# EAGLE design lcd13264-shield (EAGLE 6.5.0)
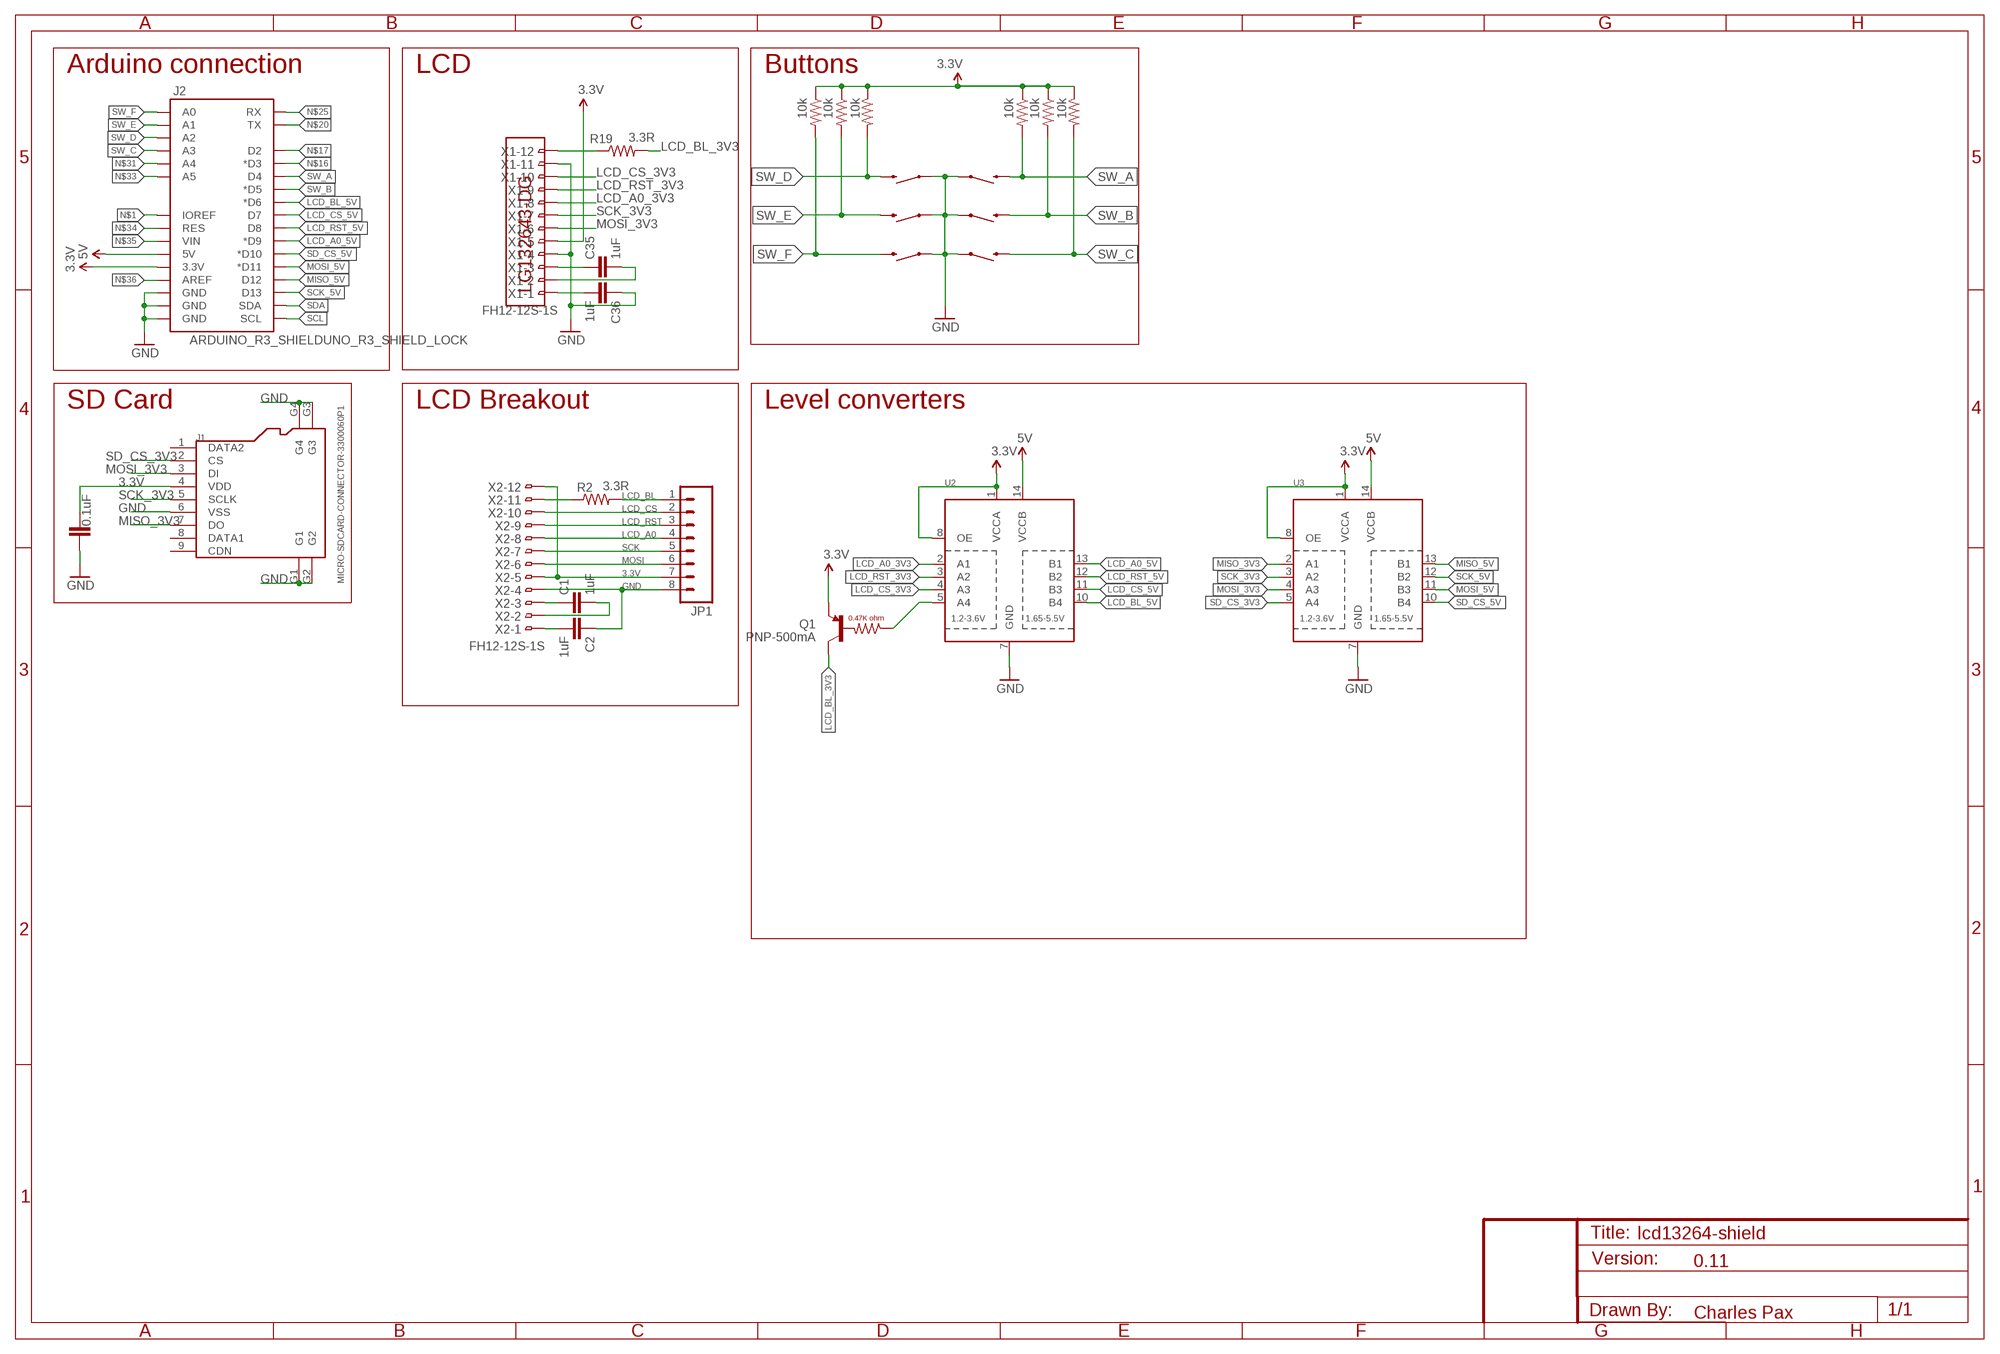
[diagram p0: schematic, sheet 1]

## Parts
C1  1uF  SPARKFUN-CAPACITORS_CAP0603-CAP  [SPARKFUN-CAPACITORS_0603-CAP]
C2  1uF  SPARKFUN-CAPACITORS_CAP0603-CAP  [SPARKFUN-CAPACITORS_0603-CAP]
C21  0.1uF  SPARKFUN-CAPACITORS_CAP0603-CAP  [SPARKFUN-CAPACITORS_0603-CAP]
C35  1uF  SPARKFUN-CAPACITORS_CAP0603-CAP  [SPARKFUN-CAPACITORS_0603-CAP]
C36  1uF  SPARKFUN-CAPACITORS_CAP0603-CAP  [SPARKFUN-CAPACITORS_0603-CAP]
J1  MICRO-SDCARD-CONNECTOR-3300060P1  [9P-SMD-W-RING]
J2  ARDUINO_R3_SHIELDUNO_R3_SHIELD_LOCK  [UNO_R3_SHIELD_LOCK]
JP1  M08  [1X08_ROUND]
Q1  PNP-500mA  TRANSISTOR-PNP-DDTB142TC  [SOT23-3]
R1  10k  SPARKFUN-RESISTORS_RESISTOR0603-RES  [SPARKFUN-RESISTORS_0603-RES]
R2  3.3R  SPARKFUN-RESISTORS_RESISTOR0603-RES  [SPARKFUN-RESISTORS_0603-RES]
R8  10k  SPARKFUN-RESISTORS_RESISTOR0603-RES  [SPARKFUN-RESISTORS_0603-RES]
R11  10k  SPARKFUN-RESISTORS_RESISTOR0603-RES  [SPARKFUN-RESISTORS_0603-RES]
R12  10k  SPARKFUN-RESISTORS_RESISTOR0603-RES  [SPARKFUN-RESISTORS_0603-RES]
R15  10k  SPARKFUN-RESISTORS_RESISTOR0603-RES  [SPARKFUN-RESISTORS_0603-RES]
R16  10k  SPARKFUN-RESISTORS_RESISTOR0603-RES  [SPARKFUN-RESISTORS_0603-RES]
R19  3.3R  SPARKFUN-RESISTORS_RESISTOR0603-RES  [SPARKFUN-RESISTORS_0603-RES]
S1  SWITCH-MOMENTARY-2SMD  [TACTILE_SWITCH_SMD]
S2  SWITCH-MOMENTARY-2SMD  [TACTILE_SWITCH_SMD]
S3  SWITCH-MOMENTARY-2SMD  [TACTILE_SWITCH_SMD]
S4  SWITCH-MOMENTARY-2SMD  [TACTILE_SWITCH_SMD]
S5  SWITCH-MOMENTARY-2SMD  [TACTILE_SWITCH_SMD]
S6  SWITCH-MOMENTARY-2SMD  [TACTILE_SWITCH_SMD]
U2  TXB0104PWRSOIC14  [SO14]
U3  TXB0104PWRSOIC14  [SO14]
U$5  LG132643-DG  [LG132643-DG]
X1  FH12-12S-1S  [FH12-12S-1SH]
X2  FH12-12S-1S  [FH12-12S-1SH]

## Nets
3.3V: C21.2 J1.4(VDD) J2.3.3V Q1.2(E) R1.1 R8.1 R11.1 R12.1 R15.1 R16.1 U2.1(VCCA) U2.8(OE) U3.1(VCCA) U3.8(OE) X1.5
5V: J2.5V U2.14(VCCB) U3.14(VCCB)
GND: C21.1 C36.1 J1.6(VSS) J1.G1 J1.G2 J1.G3 J1.G4 J2.GND@0(GND) J2.GND@1(GND) J2.GND@2(GND) S1.1 S2.1 S3.1 S4.1 S5.1 S6.1 U2.7(GND) U3.7(GND) X1.4 X1.11
LCD_A0_3V3: U2.2(A1) X1.8
LCD_A0_5V: J2.D9(*D9) U2.13(B1)
LCD_BL_3V3: Q1.3(C) R19.2
LCD_BL_5V: J2.D6(*D6) U2.10(B4)
LCD_CS_3V3: U2.4(A3) X1.10
LCD_CS_5V: J2.D7 U2.11(B3)
LCD_RST_3V3: U2.3(A2) X1.9
LCD_RST_5V: J2.D8 U2.12(B2)
MISO_3V3: J1.7(DO) U3.2(A1)
MISO_5V: J2.D12 U3.13(B1)
MOSI_3V3: J1.3(DI) U3.4(A3) X1.6
MOSI_5V: J2.D11(*D11) U3.11(B3)
N$1: J2.IOREF
N$4: R19.1 X1.12
N$16: J2.D3(*D3)
N$17: J2.D2
N$20: J2.TX
N$25: J2.RX
N$31: J2.A4
N$33: J2.A5
N$34: J2.RES
N$35: J2.VIN
N$36: J2.AREF
N$37: C35.1 X1.3
N$38: C35.2 X1.2
N$39: C36.2 X1.1
N$40: C1.1 X2.3
N$41: C1.2 X2.2
N$42: C2.2 X2.1
N$43: R2.1 X2.11
N$45: C2.1 JP1.8 X2.4
N$47: JP1.7 X2.5 X2.12
N$51: JP1.1 R2.2
N$52: JP1.2 X2.10
N$53: JP1.3 X2.9
N$54: JP1.4 X2.8
N$55: JP1.5 X2.7
N$56: JP1.6 X2.6
N$57: Q1.1(B) U2.5(A4)
SCK_3V3: J1.5(SCLK) U3.3(A2) X1.7
SCK_5V: J2.D13 U3.12(B2)
SCL: J2.SCL
SD_CS_3V3: J1.2(CS) U3.5(A4)
SD_CS_5V: J2.D10(*D10) U3.10(B4)
SDA: J2.SDA
SW_A: J2.D4 R8.2 S3.3
SW_B: J2.D5(*D5) R11.2 S2.3
SW_C: J2.A3 R12.2 S1.3
SW_D: J2.A2 R15.2 S4.3
SW_E: J2.A1 R16.2 S5.3
SW_F: J2.A0 R1.2 S6.3
Unconnected: J1.1(DATA2) J1.8(DATA1) J1.9(CDN)

## Notes on the sheet
- Arduino connection | LCD | Buttons
- SD Card | LCD Breakout | Level converters
- LCD_BL
- LCD_CS
- LCD_RST
- LCD_A0
- SCK
- MOSI
- 3.3V
- GND
- 0.11
- Charles Pax

## Library data of the parts
C1 C2 C35 C36 = PaxInstrument-T400:SPARKFUN-CAPACITORS_CAP: Capacitor Standard 0603 ceramic capacitor, and 0.1" leaded capacitor.; MPN: LMK107B7105KA-T; OC_DIGIKEY: 587-1242-2-ND
C21 = PaxInstrument-T400:SPARKFUN-CAPACITORS_CAP: Capacitor Standard 0603 ceramic capacitor, and 0.1" leaded capacitor.; MPN: CL10B104KO8NNNC; OC_DIGIKEY: 1276-1005-2-ND
J1 = PaxInstrument-T400:MICRO-SDCARD-CONNECTOR: Micro SD Card
J2 = SparkFun-Boards:ARDUINO_R3_SHIELD: Shield form compatible with the Arduino Uno R3.
JP1 = SparkFun-Connectors:M08: Header 8 Standard 8-pin 0.1" header. Use with straight break away headers (SKU : PRT-00116), right angle break away headers (PRT-00553), swiss pins (PRT-00743), machine pins (PRT-00117), and female headers (PRT-00115).
Q1 = SparkFun-DiscreteSemi:TRANSISTOR-PNP-DDTB142TC: PNP transistor with base resistor.; PROD_ID: TRANS-11479
R1 R8 R11 R12 R15 R16 = PaxInstrument-T400:SPARKFUN-RESISTORS_RESISTOR: Resistor Basic schematic elements and footprints for 0603, 1206, and PTH resistors.; MPN: RC1608J103CS; OC_DIGIKEY: 1276-5086-2-ND
R2 R19 = PaxInstrument-T400:SPARKFUN-RESISTORS_RESISTOR: Resistor Basic schematic elements and footprints for 0603, 1206, and PTH resistors.
S1-S6 = SparkFun-Electromechanical:SWITCH-MOMENTARY-2: Various NO switches- pushbuttons, reed, etc
U2 U3 = SparkFun-DigitalIC:TXB0104PWR: 4-Bit Bi-Directional Level Shifter 1.2V-3.6V (VCCA) to 1.65V-5.5V (VCCB) bi-directional level shifter with auto direction sensing. Max data rate - VCCA 1.8V: 20Mbps (50ns), VCCA 3.3V: 100Mbps (10ns) Digikey: 296-21929-1-ND (TSSOP) IC-11329; PROD_ID: IC-11329
U$5 = charlespax:LG132643-DG; MPN: LG132643-DW
X1 X2 = PaxInstrument-T400:FH12-12S-1S

## Net classes
0 default: width 0.203 mm, drill 0.33 mm
1 power: width 0.305 mm

## Board
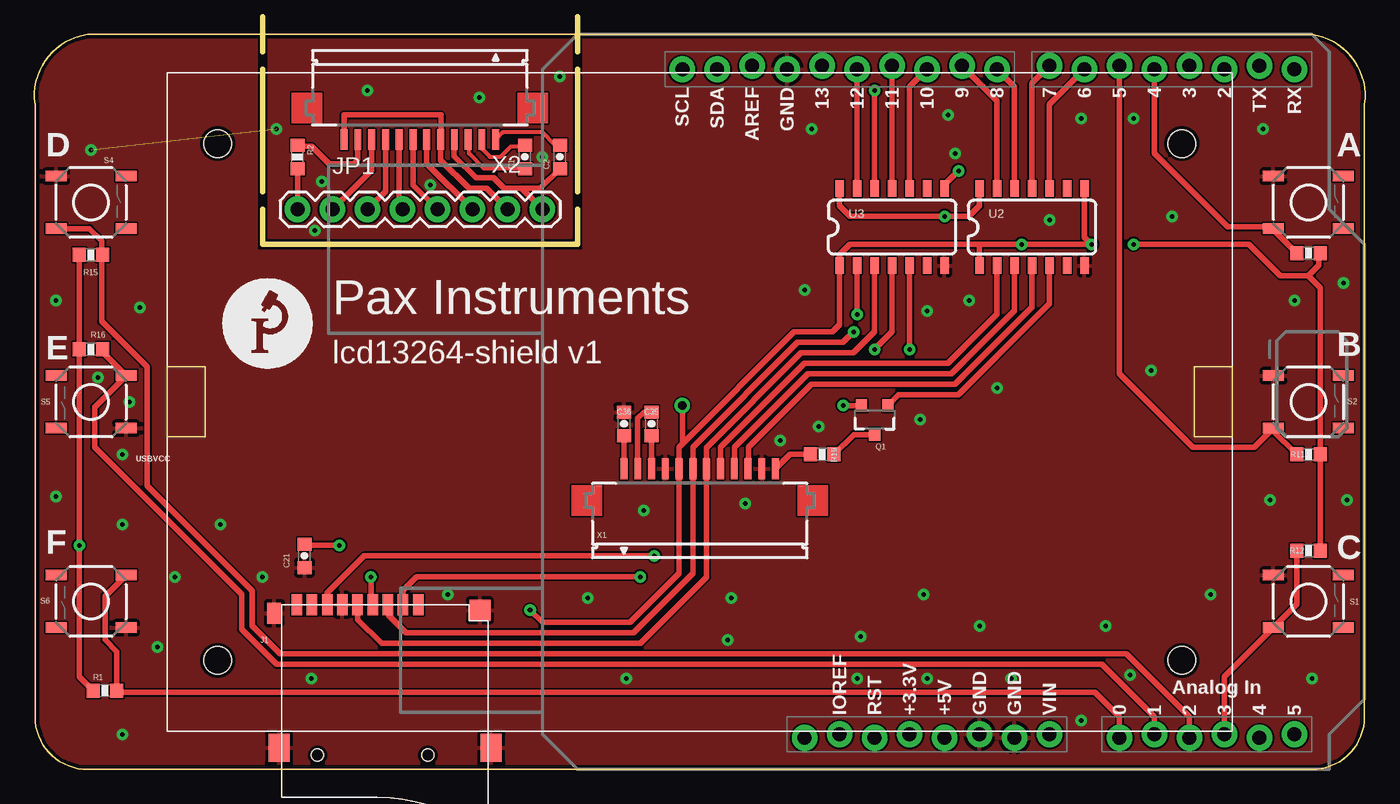
[diagram p1: board, top side]
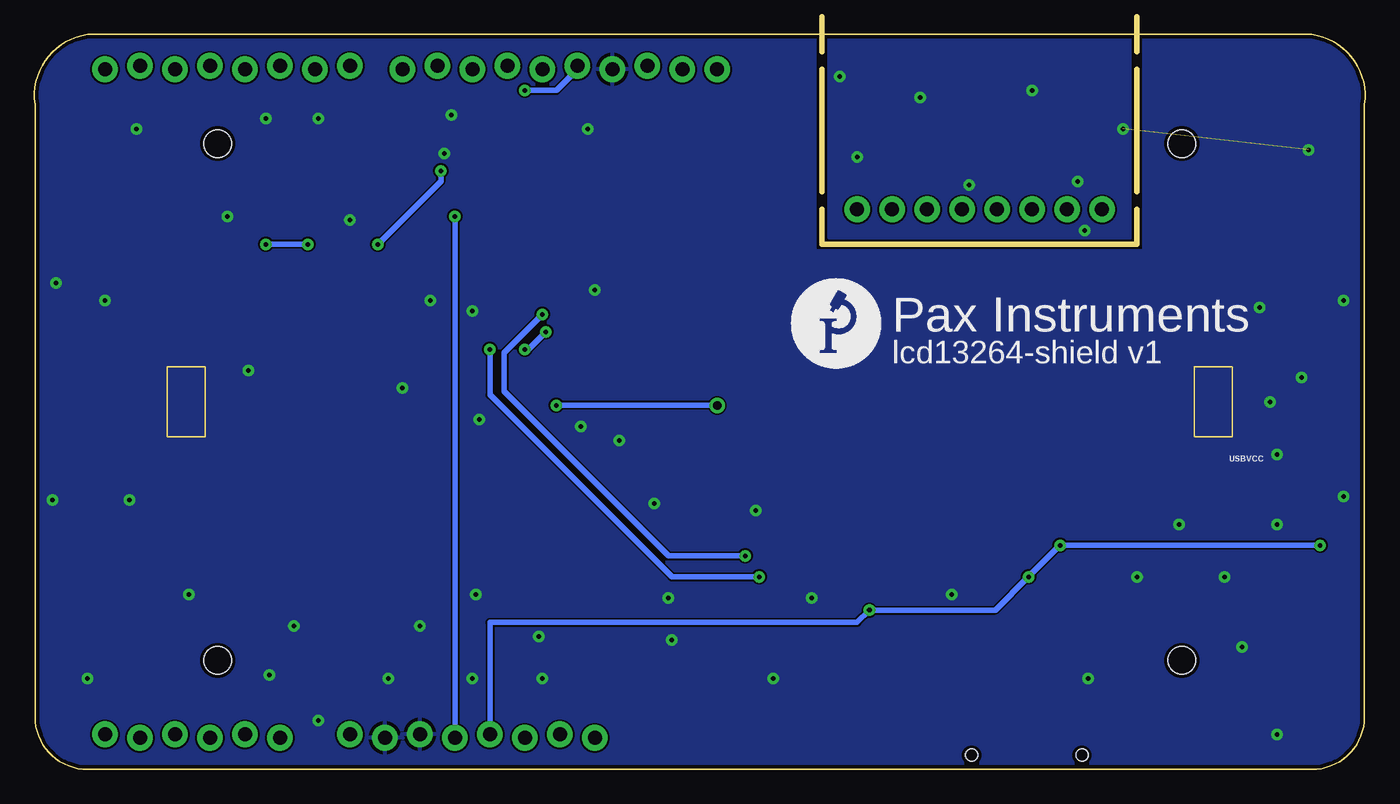
[diagram p2: board, bottom side, seen from below]

Size 96.6 x 53.34 mm. Coordinates in mm from the lower left corner, seen from the top.
Outline: 92.75,0 3.85,0 arc-90 0.04,3.81 0.04,48.26 arc-90 3.85,53.34 92.75,53.34 arc-90 96.56,48.26 96.56,3.81 arc-90 92.75,0
Copper layers (1*16): Top 0.035mm / dielectric 1.5mm / Bottom 0.035mm
Design rules "PaxInstrument-T400 *": minimum track width 6mil, minimum drill 13mil, track to track 5mil, track to pad 5mil, pad to pad 5mil, via to via 5mil, smd to smd 5mil, copper to edge 10mil, drill to drill 8mil, minimum pad ring 12mil, minimum via ring 10mil, stop-mask expansion 4mil, vias tented up to drill 25mil, thermal gap 10mil
Milling: 7 lines

### Footprints (pad centres in the part's own frame; a part is rotated, then mirrored left to right if it is on the bottom)
SPARKFUN-CAPACITORS_0603-CAP = smd 0.94 x 1.016: 1 -0.85,0; 2 0.85,0
9P-SMD-W-RING = smd 1.524 x 0.762: 1 -7.493,2.414; 2 -7.493,1.314; 3 -7.493,0.214; 4 -7.493,-0.886; 5 -7.493,-1.986; 6 -7.493,-3.086; 7 -7.493,-4.186; 8 -7.493,-5.286; 9 -7.493,-6.386 | smd 1.524 x 1.016: G1 -6.893,-8.032 | smd 2.032 x 1.524: G2 2.88,-7.686; G3 2.88,7.714 | smd 1.524 x 1.524: G4 -7.101,6.895 | hole 0.889: 3.407,-4.886; 3.407,3.114
UNO_R3_SHIELD_LOCK = drill 1.016 pad 1.88: 3.3V 50.8,26.67; 5V 51.054,29.21; A0 51.054,41.91; A1 50.8,44.45; A2 51.054,46.99; A3 50.8,49.53; A4 51.054,52.07; A5 50.8,54.61; AREF 2.286,15.24; D2 2.54,49.53; D3 2.286,46.99; D4 2.54,44.45; D5 2.286,41.91; D6 2.54,39.37; D7 2.286,36.83; D8 2.54,33.02; D9 2.286,30.48; D10 2.54,27.94; D11 2.286,25.4; D12 2.54,22.86; D13 2.286,20.32; GND@0 50.8,31.75; GND@1 51.054,34.29; GND@2 2.54,17.78; IOREF 50.8,21.59; NC 51.054,19.05; RES 51.054,24.13; RX 2.54,54.61; SCL 2.54,10.16; SDA 2.54,12.7; TX 2.286,52.07; VIN 50.8,36.83
1X08_ROUND = drill 1.016 pad 1.88: 1 0,0; 2 2.54,0; 3 5.08,0; 4 7.62,0; 5 10.16,0; 6 12.7,0; 7 15.24,0; 8 17.78,0
SOT23-3 = smd 0.8 x 0.9: 1 -0.95,-1; 2 0.95,-1; 3 0,1.1
SPARKFUN-RESISTORS_0603-RES = smd 0.94 x 1.016: 1 -0.85,0; 2 0.85,0
TACTILE_SWITCH_SMD = smd 1.524 x 0.762: 1 -2.54,1.905; 2 2.54,1.905; 3 -2.54,-1.905; 4 2.54,-1.905
SO14 = smd 0.6 x 1.2: 1 -3.81,-2.8; 2 -2.54,-2.8; 3 -1.27,-2.8; 4 0,-2.8; 5 1.27,-2.8; 6 2.54,-2.8; 7 3.81,-2.8; 8 3.81,2.8; 9 2.54,2.8; 10 1.27,2.8; 11 0,2.8; 12 -1.27,2.8; 13 -2.54,2.8; 14 -3.81,2.8
LG132643-DG = hole 2: -35,-18.75; 35,-18.75; 35,18.75; -35,18.75
FH12-12S-1SH = smd 0.5 x 1.5: 1 -5.5,2.297; 2 -4.5,2.297; 3 -3.5,2.297; 4 -2.5,2.297; 5 -1.5,2.297; 6 -0.5,2.297; 7 0.5,2.297; 8 1.5,2.297; 9 2.5,2.297; 10 3.5,2.297; 11 4.5,2.297; 12 5.5,2.297

### Placement (x,y rotation side)
C1  35.6,44.45 90 top
C2  38.14,44.45 90 top
C21  19.6,15.49 90 top
C35  44.8,25.08 90 top
C36  42.8,25.08 270 top
J1  25.44,4.45 270 top
J2  36.87,53.34 270 top
JP1  19.09,40.64 0 top
Q1  61,25.4 180 top
R1  5.12,5.71 0 top
R2  19.09,44.45 270 top
R8  92.5,37.47 180 top
R11  92.5,22.86 180 top
R12  92.5,15.88 180 top
R15  4.1,37.34 0 top
R16  4.1,30.48 0 top
R19  57.19,22.86 0 top
S1  92.5,12.19 0 top
S2  92.5,26.67 0 top
S3  92.5,41.15 0 top
S4  4.1,41.15 0 top
S5  4.1,26.67 180 top
S6  4.1,12.19 180 top
U2  72.43,39.37 0 top
U3  62.27,39.37 0 top
U$1  [PAXINSTRUMENT_LOGO]  13.5,28.96 0 top
U$5  48.3,26.67 0 bottom
U$6  [PAXINSTRUMENT_LOGO]  41.82,28.96 0 bottom
X1  48.3,19.52 0 top
X2  27.98,48.01 180 top

### Tracks (layer width: path | path; a pad name or v marks a point on that pad's centre or on a via)
3.3V  (via drill 0.33, 0.6)
  Top 0.406: v35.98,11.56 36.87,10.67 43.22,10.67 46.78,14.22 46.78,21.82 X1.5 46.8,23.39 47.03,23.62 | v24.42,13.97 24.42,12.07 J1.4 | v58.71,26.42 58.71,26.4 Q1.2 | 47.03,23.62 55.16,31.75 57.95,31.75 58.46,32.26 U3.1 58.46,37.34 59.22,38.1 68.62,38.1 | v47.03,26.42 47.03,23.62 | 92.5,35.81 90.46,35.81 88.18,38.1 v79.8,38.1 | 92.5,35.81 93.26,36.58 93.26,37.38 R8.1 | U2.1 68.62,38.1 | 92.5,35.81 93.35,34.96 R11.1 R12.1 | R15.1 R16.1 v3.25,16.26 3.25,6.73 R1.1 | 19.51,16.26 C21.2 19.69,16.26 v22.14,16.26 | 68.62,38.1 v71.67,38.1 72.94,38.1 v76.75,38.1 76.24,38.61 U2.8 | U3.8 66.08,42.42 v67.1,43.43
  Bottom 0.406: v47.03,26.42 v58.71,26.42 | J2.3.3V 63.54,10.67 36.87,10.67 v35.98,11.56 26.84,11.56 v24.42,13.97 v22.14,16.26 v3.25,16.26 | v76.75,38.1 v79.8,38.1 | v67.1,43.43 67.1,42.67 v71.67,38.1
5V  (via drill 0.33)
  Top 0.406: U3.14 58.46,40.89 59.22,40.13 v66.08,40.13 67.86,40.13 68.62,40.89 U2.14
  Bottom 0.406: v66.08,40.13 J2.5V
GND  (via drill 0.33)  (1 unrouted)
  other vias: 54.14,23.88 56.94,24.89 6.39,22.86 6.39,17.78 6.39,2.54 8.93,8.89 10.2,13.97 16.55,13.97 20.11,6.6 42.97,6.6 59.73,6.6 64.81,6.6 70.91,6.6 79.54,6.86 59.98,9.65 50.33,9.4 40.17,12.45 30.01,12.7 44.24,18.8 51.6,19.3 13.5,17.78 1.56,19.81 1.56,34.04 4.1,44.96 7.66,33.53 4.61,28.45 6.9,26.67 20.87,42.67 32.3,48.77 24.17,49.28 38.14,50.29 28.74,42.42 66.33,47.5 66.84,44.7 73.7,39.88 56.43,46.48 55.92,34.8 64.81,33.27 67.86,34.04 64.3,25.4 69.89,27.69 81.07,28.96 91.48,34.04 82.59,40.13 79.8,47.24 75.99,47.24 89.19,46.48 95.29,19.56 95.04,35.31 89.7,19.56 77.76,10.41 68.62,10.41 64.56,12.7 50.59,12.45 75.99,3.56 92.75,6.6 85.38,12.7 36.87,44.45 20.36,39.12 17.57,46.48
  pour Bottom: 96.56,53.34 96.56,0 0.04,0 0.04,53.34 16.04,53.34 16.04,37.59 39.92,37.59 39.92,53.34
  pour Top: 96.56,53.34 96.56,0 0.04,0 0.04,53.34 16.04,53.34 16.04,37.59 39.92,37.59 39.92,53.34
  pour Top: 38.9,53.34 38.9,38.61 17.06,38.61 17.06,53.34
  pour Bottom: 38.9,53.34 38.9,38.61 17.06,38.61 17.06,53.34
LCD_A0_3V3
  Top 0.406: U2.2 69.89,33.02 66.33,29.46 55.92,29.46 49.82,23.37 49.82,21.85 X1.8
LCD_A0_5V
  Top 0.406: U2.13 69.89,48.51 J2.D9
LCD_BL_3V3
  Top 0.406: Q1.3 59.48,24.3 R19.2
LCD_BL_5V
  Top 0.406: U2.10 73.7,48.26 J2.D6
LCD_CS_3V3
  Top 0.406: U2.4 72.43,33.53 66.84,27.94 56.43,27.94 51.86,23.37 51.86,21.88 X1.10
LCD_CS_5V
  Top 0.406: U2.11 72.43,49.78 J2.D7
LCD_RST_3V3
  Top 0.406: U2.3 71.16,33.27 66.59,28.7 56.17,28.7 50.84,23.37 50.84,21.86 X1.9
LCD_RST_5V
  Top 0.406: U2.12 71.16,49.53 J2.D8
MISO_3V3  (via drill 0.33)
  Top 0.406: U3.2 v59.73,33.02 | J1.7 21.25,12.83 23.92,15.49 v45,15.49
  Bottom 0.406: v59.73,33.02 62.52,30.23 62.52,27.43 50.59,15.49 v45,15.49
MISO_5V
  Top 0.406: U3.13 J2.D12
MOSI_3V3  (via drill 0.33)
  Top 0.406: J1.3 25.69,11.9 25.69,11.18 26.96,9.91 43.47,9.91 47.8,14.23 X1.6 47.8,23.38 55.41,30.99 58.71,30.99 v59.48,31.75 | v61,30.48 62.27,31.75 U3.4
  Bottom 0.406: v61,30.48 60.75,30.48 v59.48,31.75
MOSI_5V
  Top 0.406: U3.11 J2.D11
N$4
  Top 0.406: R19.1 54.84,22.86 X1.12
N$37
  Top 0.406: C35.1 X1.3
N$38
  Top 0.406: C35.2 44.78,25.91 44.24,25.91 43.8,25.47 X1.2
N$39
  Top 0.406: C36.2 X1.1
N$40
  Top 0.305: C1.1 32.64,43.6 31.54,44.7 31.54,45.65 X2.3
N$41
  Top 0.305: X2.2 32.48,45.03 33.06,44.45 33.82,44.45 34.58,45.21 35.51,45.21 C1.2
N$42
  Top 0.305: C2.2 37.8,45.3 36.87,46.23 34,46.23 X2.1
N$43
  Top 0.406: R2.1 19.18,45.21 20.11,45.21 21.38,43.94 23.15,43.94 23.48,44.27 X2.11
N$45
  Top 0.406: X2.4 30.48,44.49 32.04,42.93 33.31,42.93 34.08,42.16 35.35,42.16 | 35.35,42.16 JP1.8 | C2.1 36.7,42.16 35.35,42.16
N$47
  Top 0.406: JP1.7 32.81,42.16 31.54,42.16 29.48,44.22 X2.5 29.5,45.71 29.5,47.5 22.48,47.5 X2.12
N$51
  Top 0.406: JP1.1 R2.2
N$52
  Top 0.406: JP1.2 24.48,43.49 X2.10
N$53
  Top 0.406: JP1.3 25.48,41.95 X2.9
N$54
  Top 0.406: JP1.4 26.48,40.87 X2.8
N$55
  Top 0.406: JP1.5 27.48,42.41 X2.7
N$56
  Top 0.406: JP1.6 28.48,43.95 X2.6
N$57
  Top 0.406: U2.5 73.7,33.78 67.1,27.18 62.73,27.18 Q1.1
SCK_3V3
  Top 0.406: J1.5 23.45,10.88 25.19,9.14 43.98,9.14 48.8,13.96 X1.7 48.8,23.36 55.67,30.23 59.48,30.23 61,31.75 U3.3
SCK_5V  (via drill 0.33)
  Top 0.406: U3.12 v61,49.28
  Bottom 0.406: v61,49.28 58.71,49.28 57.19,50.8 J2.D13
SD_CS_3V3  (via drill 0.33)
  Top 0.406: U3.5 v63.54,30.48 | J1.2 26.75,13 27.73,13.97 v43.98,13.97
  Bottom 0.406: v63.54,30.48 63.54,27.18 50.33,13.97 v43.98,13.97
SD_CS_5V
  Top 0.406: U3.10 63.54,49.53 J2.D10
SW_A
  Top 0.406: J2.D4 81.32,44.7 86.65,39.37 89.83,39.37 S3.3 89.96,39.16 R8.2
SW_B
  Top 0.406: J2.D5 78.78,28.7 84.11,23.37 88.56,23.37 S2.3 89.96,24.55 R11.2
SW_C
  Top 0.406: R12.2 91.65,11.98 S1.3 86.4,6.73 J2.A3
SW_D
  Top 0.406: S4.3 3.98,39.24 4.87,38.35 4.87,37.43 R15.2 4.87,37.25 4.87,32.51 8.17,29.21 8.17,20.57 15.79,12.95 15.79,10.41 17.82,8.38 79.29,8.38 83.86,3.81 J2.A2
SW_E
  Top 0.406: R16.2 4.95,30.27 S5.3 4.36,26.29 4.36,23.37 15.03,12.7 15.03,10.16 17.57,7.62 77.51,7.62 81.32,3.81 J2.A1
SW_F
  Top 0.406: S6.3 5.12,12.57 5.12,9.4 5.97,8.55 R1.2 6.1,5.59 77,5.59 78.78,3.81 J2.A0

### Text on the board
tPlace: D | A | Pax Instruments | E | B | lcd13264-shield v1 | USBVCC | F | C
bPlace: Pax Instruments | lcd13264-shield v1 | USBVCC
tDocu: SDA | SCL | SCK | MISO | MOSI | SD_CS | SW_D | SW_E | LCD_BL | SW_C | SW_B | SW_A | WS_WSPEED | WS_RAIN | WS_WDIR | WS_LIGHT | WS_3v3 | SDA | SCL